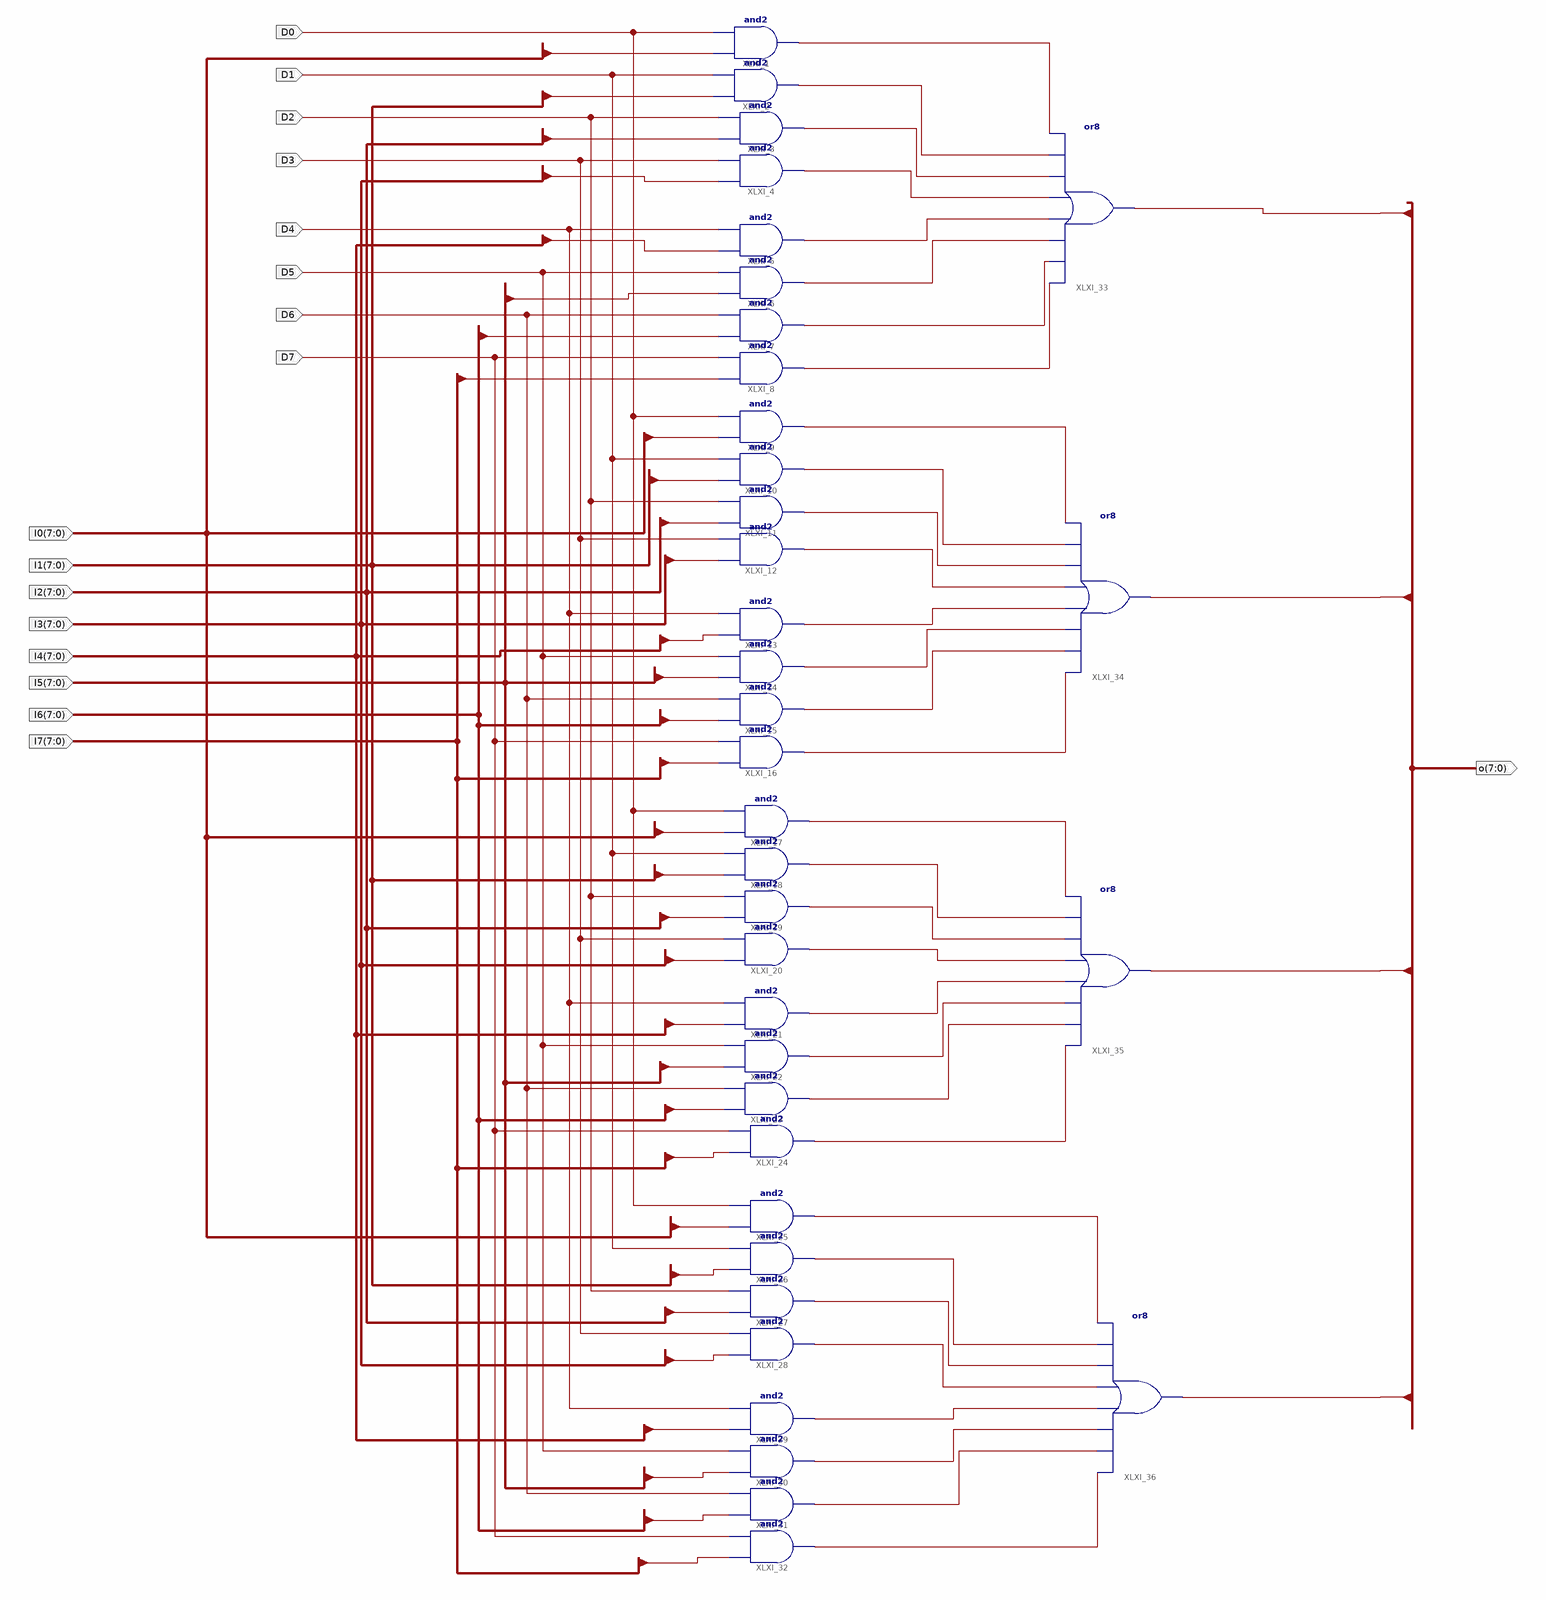
[diagram p0: schematic sheet 1]
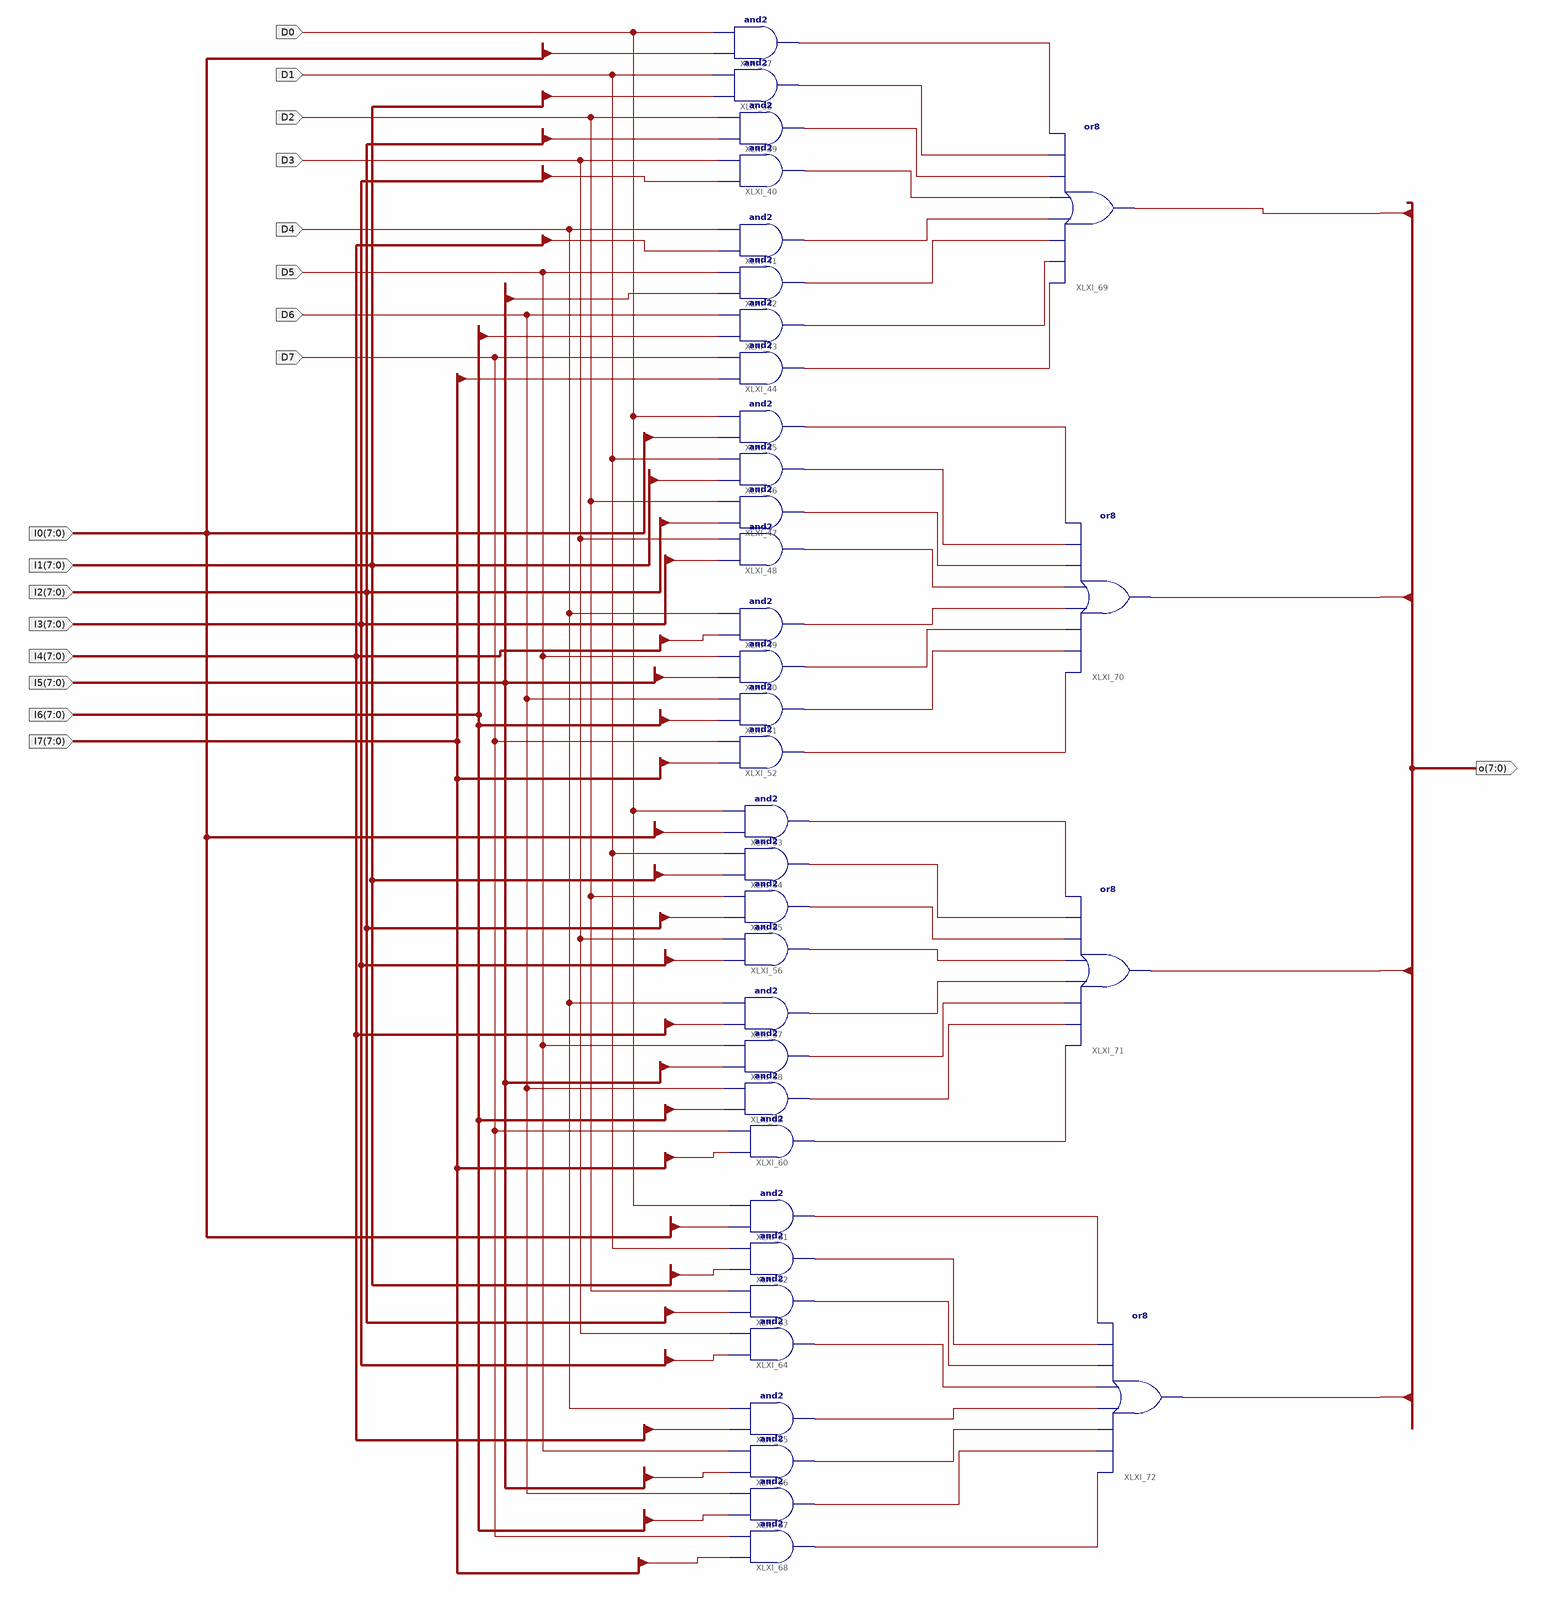
[diagram p1: schematic sheet 2]
// Xilinx ISE schematic MUX8T1.sch (spartan3) as structural Verilog: 72 symbols, 17 ports
module MUX8T1 (
  input  D0,
  input  D1,
  input  D2,
  input  D3,
  input  D4,
  input  D5,
  input  D6,
  input  D7,
  input  [7:0] I0,
  input  [7:0] I1,
  input  [7:0] I2,
  input  [7:0] I3,
  input  [7:0] I4,
  input  [7:0] I5,
  input  [7:0] I6,
  input  [7:0] I7,
  output [7:0] o
);

  wire XLXN_1, XLXN_2, XLXN_3, XLXN_4, XLXN_5, XLXN_6, XLXN_7, XLXN_8, XLXN_9, XLXN_10, XLXN_11, XLXN_12,
       XLXN_13, XLXN_14, XLXN_15, XLXN_16, XLXN_17, XLXN_18, XLXN_19, XLXN_20, XLXN_21, XLXN_22, XLXN_23,
       XLXN_24, XLXN_25, XLXN_26, XLXN_27, XLXN_28, XLXN_29, XLXN_30, XLXN_31, XLXN_32, XLXN_162, XLXN_163,
       XLXN_164, XLXN_165, XLXN_166, XLXN_167, XLXN_169, XLXN_170, XLXN_171, XLXN_172, XLXN_173, XLXN_174,
       XLXN_175, XLXN_176, XLXN_177, XLXN_178, XLXN_179, XLXN_180, XLXN_181, XLXN_182, XLXN_183, XLXN_184,
       XLXN_185, XLXN_186, XLXN_187, XLXN_188, XLXN_189, XLXN_190, XLXN_191, XLXN_192, XLXN_193, XLXN_194;

  and XLXI_1 (XLXN_1, I0[0], D0);
  and XLXI_2 (XLXN_2, I1[0], D1);
  and XLXI_3 (XLXN_3, I2[0], D2);
  and XLXI_4 (XLXN_4, I3[0], D3);
  and XLXI_5 (XLXN_5, I4[0], D4);
  and XLXI_6 (XLXN_6, I5[0], D5);
  and XLXI_7 (XLXN_7, I6[0], D6);
  and XLXI_8 (XLXN_8, I7[0], D7);
  and XLXI_9 (XLXN_16, I0[1], D0);
  and XLXI_10 (XLXN_15, I1[1], D1);
  and XLXI_11 (XLXN_14, I2[1], D2);
  and XLXI_12 (XLXN_13, I3[1], D3);
  and XLXI_13 (XLXN_12, I4[1], D4);
  and XLXI_14 (XLXN_11, I5[1], D5);
  and XLXI_15 (XLXN_10, I6[1], D6);
  and XLXI_16 (XLXN_9, I7[1], D7);
  and XLXI_17 (XLXN_17, I0[2], D0);
  and XLXI_18 (XLXN_18, I1[2], D1);
  and XLXI_19 (XLXN_19, I2[2], D2);
  and XLXI_20 (XLXN_20, I3[2], D3);
  and XLXI_21 (XLXN_21, I4[2], D4);
  and XLXI_22 (XLXN_22, I5[2], D5);
  and XLXI_23 (XLXN_23, I6[2], D6);
  and XLXI_24 (XLXN_24, I7[2], D7);
  and XLXI_25 (XLXN_25, I0[3], D0);
  and XLXI_26 (XLXN_26, I1[3], D1);
  and XLXI_27 (XLXN_27, I2[3], D2);
  and XLXI_28 (XLXN_28, I3[3], D3);
  and XLXI_29 (XLXN_29, I4[3], D4);
  and XLXI_30 (XLXN_30, I5[3], D5);
  and XLXI_31 (XLXN_31, I6[3], D6);
  and XLXI_32 (XLXN_32, I7[3], D7);
  or XLXI_33 (o[0], XLXN_8, XLXN_7, XLXN_6, XLXN_5, XLXN_4, XLXN_3, XLXN_2, XLXN_1);
  or XLXI_34 (o[1], XLXN_9, XLXN_10, XLXN_11, XLXN_12, XLXN_13, XLXN_14, XLXN_15, XLXN_16);
  or XLXI_35 (o[2], XLXN_24, XLXN_23, XLXN_22, XLXN_21, XLXN_20, XLXN_19, XLXN_18, XLXN_17);
  or XLXI_36 (o[3], XLXN_32, XLXN_31, XLXN_30, XLXN_29, XLXN_28, XLXN_27, XLXN_26, XLXN_25);
  and XLXI_37 (XLXN_162, I0[4], D0);
  and XLXI_38 (XLXN_163, I1[4], D1);
  and XLXI_39 (XLXN_164, I2[4], D2);
  and XLXI_40 (XLXN_165, I3[4], D3);
  and XLXI_41 (XLXN_166, I4[4], D4);
  and XLXI_42 (XLXN_167, I5[4], D5);
  and XLXI_43 (XLXN_169, I6[4], D6);
  and XLXI_44 (XLXN_170, I7[4], D7);
  and XLXI_45 (XLXN_178, I0[5], D0);
  and XLXI_46 (XLXN_177, I1[5], D1);
  and XLXI_47 (XLXN_176, I2[5], D2);
  and XLXI_48 (XLXN_175, I3[5], D3);
  and XLXI_49 (XLXN_174, I4[5], D4);
  and XLXI_50 (XLXN_173, I5[5], D5);
  and XLXI_51 (XLXN_172, I6[5], D6);
  and XLXI_52 (XLXN_171, I7[5], D7);
  and XLXI_53 (XLXN_179, I0[6], D0);
  and XLXI_54 (XLXN_180, I1[6], D1);
  and XLXI_55 (XLXN_181, I2[6], D2);
  and XLXI_56 (XLXN_182, I3[6], D3);
  and XLXI_57 (XLXN_183, I4[6], D4);
  and XLXI_58 (XLXN_184, I5[6], D5);
  and XLXI_59 (XLXN_185, I6[6], D6);
  and XLXI_60 (XLXN_186, I7[6], D7);
  and XLXI_61 (XLXN_187, I0[7], D0);
  and XLXI_62 (XLXN_188, I1[7], D1);
  and XLXI_63 (XLXN_189, I2[7], D2);
  and XLXI_64 (XLXN_190, I3[7], D3);
  and XLXI_65 (XLXN_191, I4[7], D4);
  and XLXI_66 (XLXN_192, I5[7], D5);
  and XLXI_67 (XLXN_193, I6[7], D6);
  and XLXI_68 (XLXN_194, I7[7], D7);
  or XLXI_69 (o[4], XLXN_170, XLXN_169, XLXN_167, XLXN_166, XLXN_165, XLXN_164, XLXN_163, XLXN_162);
  or XLXI_70 (o[5], XLXN_171, XLXN_172, XLXN_173, XLXN_174, XLXN_175, XLXN_176, XLXN_177, XLXN_178);
  or XLXI_71 (o[6], XLXN_186, XLXN_185, XLXN_184, XLXN_183, XLXN_182, XLXN_181, XLXN_180, XLXN_179);
  or XLXI_72 (o[7], XLXN_194, XLXN_193, XLXN_192, XLXN_191, XLXN_190, XLXN_189, XLXN_188, XLXN_187);
endmodule
